# EAGLE design led-strip-v2 (EAGLE 9.3.0)
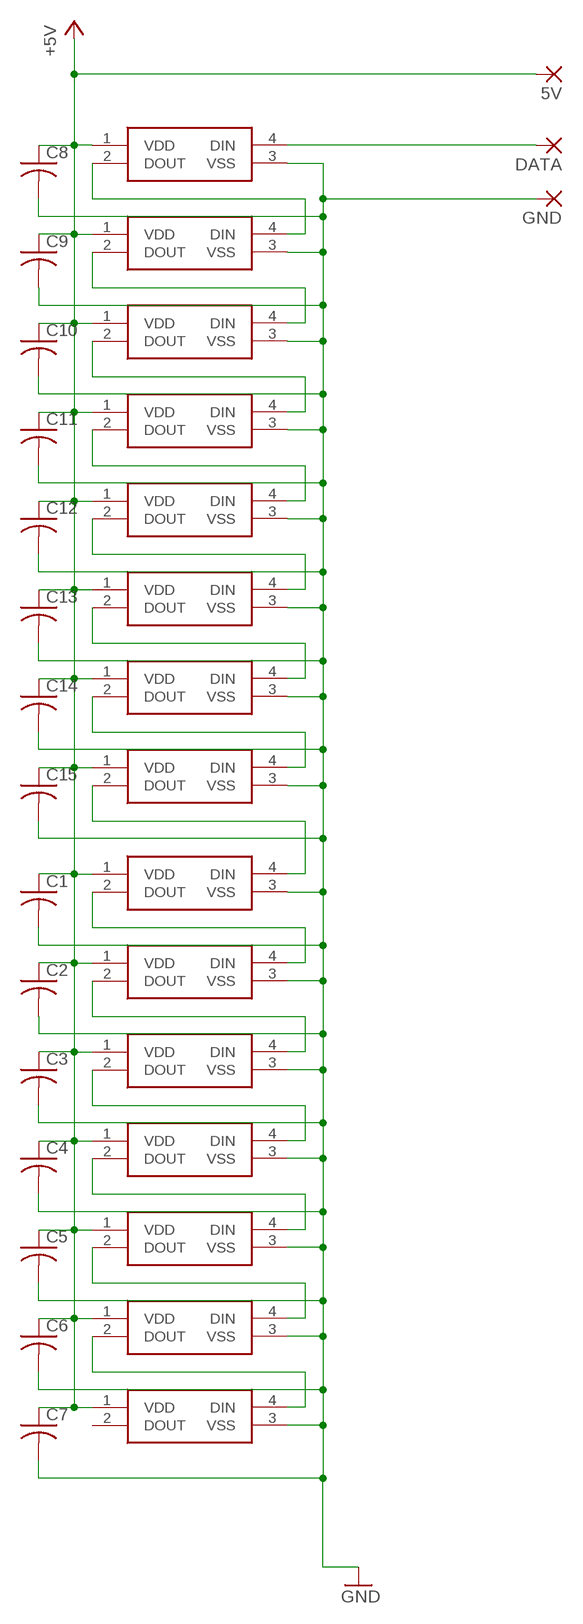
[diagram p0: schematic, sheet 1]

## Parts
5V  1,6/0,8  [1,6/0,8]
C1  C-USC0805  [C0805]
C2  C-USC0805  [C0805]
C3  C-USC0805  [C0805]
C4  C-USC0805  [C0805]
C5  C-USC0805  [C0805]
C6  C-USC0805  [C0805]
C7  C-USC0805  [C0805]
C8  C-USC0805  [C0805]
C9  C-USC0805  [C0805]
C10  C-USC0805  [C0805]
C11  C-USC0805  [C0805]
C12  C-USC0805  [C0805]
C13  C-USC0805  [C0805]
C14  C-USC0805  [C0805]
C15  C-USC0805  [C0805]
DATA  1,6/0,8  [1,6/0,8]
GND  1,6/0,8  [1,6/0,8]
LED1  1655  [WS2812B_1]
LED2  1655  [WS2812B_1]
LED3  1655  [WS2812B_1]
LED4  1655  [WS2812B_1]
LED5  1655  [WS2812B_1]
LED6  1655  [WS2812B_1]
LED7  1655  [WS2812B_1]
LED8  1655  [WS2812B_1]
LED9  1655  [WS2812B_1]
LED10  1655  [WS2812B_1]
LED11  1655  [WS2812B_1]
LED12  1655  [WS2812B_1]
LED13  1655  [WS2812B_1]
LED14  1655  [WS2812B_1]
LED15  1655  [WS2812B_1]

## Nets
+5V: 5V.1(P) C1.1 C2.1 C3.1 C4.1 C5.1 C6.1 C7.1 C8.1 C9.1 C10.1 C11.1 C12.1 C13.1 C14.1 C15.1 LED1.1(VDD) LED2.1(VDD) LED3.1(VDD) LED4.1(VDD) LED5.1(VDD) LED6.1(VDD) LED7.1(VDD) LED8.1(VDD) LED9.1(VDD) LED10.1(VDD) LED11.1(VDD) LED12.1(VDD) LED13.1(VDD) LED14.1(VDD) LED15.1(VDD)
DATA-IN: DATA.1(P) LED1.4(DIN)
GND: C1.2 C2.2 C3.2 C4.2 C5.2 C6.2 C7.2 C8.2 C9.2 C10.2 C11.2 C12.2 C13.2 C14.2 C15.2 GND.1(P) LED1.3(VSS) LED2.3(VSS) LED3.3(VSS) LED4.3(VSS) LED5.3(VSS) LED6.3(VSS) LED7.3(VSS) LED8.3(VSS) LED9.3(VSS) LED10.3(VSS) LED11.3(VSS) LED12.3(VSS) LED13.3(VSS) LED14.3(VSS) LED15.3(VSS)
N$1: LED1.2(DOUT) LED2.4(DIN)
N$2: LED2.2(DOUT) LED3.4(DIN)
N$3: LED3.2(DOUT) LED4.4(DIN)
N$4: LED4.2(DOUT) LED5.4(DIN)
N$5: LED5.2(DOUT) LED6.4(DIN)
N$6: LED6.2(DOUT) LED7.4(DIN)
N$7: LED7.2(DOUT) LED8.4(DIN)
N$8: LED8.2(DOUT) LED9.4(DIN)
N$9: LED9.2(DOUT) LED10.4(DIN)
N$10: LED10.2(DOUT) LED11.4(DIN)
N$11: LED11.2(DOUT) LED12.4(DIN)
N$12: LED12.2(DOUT) LED13.4(DIN)
N$13: LED13.2(DOUT) LED14.4(DIN)
N$14: LED14.2(DOUT) LED15.4(DIN)
Unconnected: LED15.2(DOUT)

## Library data of the parts
5V DATA GND = wirepad:1,6/0,8: THROUGH-HOLE PAD
C1-C15 = rcl:C-US: CAPACITOR, American symbol; SPICEPREFIX: C
LED1 = sk6812:1655: Intelligent control LED integrated light source, 4-pin SMD Source: Datasheet <http://www.adafruit.com/datasheets/WS2812B.pdf>; ALLIED_NUMBER: 70928826; DESCRIPTION: Intelligent control LED integrated light source, 4-pin SMD; HEIGHT: mm; MANUFACTURER_NAME: Adafruit; MANUFACTURER_PART_NUMBER: 1655
LED2-LED15 = 1655:1655: Intelligent control LED integrated light source, 4-pin SMD Source: Datasheet <http://www.adafruit.com/datasheets/WS2812B.pdf>; ALLIED_NUMBER: 70928826; DESCRIPTION: Intelligent control LED integrated light source, 4-pin SMD; HEIGHT: mm; MANUFACTURER_NAME: Adafruit; MANUFACTURER_PART_NUMBER: 1655

## Board
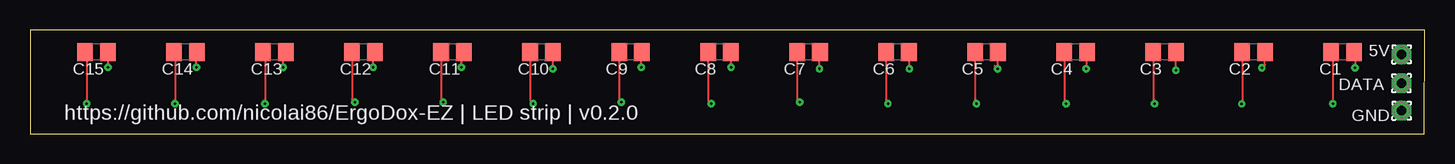
[diagram p1: board, top side]
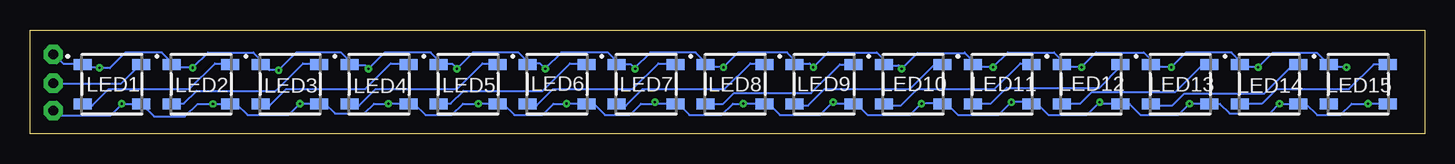
[diagram p2: board, bottom side, seen from below]

Size 116.26 x 8.68 mm. Coordinates in mm from the lower left corner, seen from the top.
Outline: 0,0 116.23,0 116.26,8.68 0,8.68 0,0
Copper layers (1*16): Top 0.035mm / dielectric 1.5mm / Bottom 0.035mm
Design rules "default": minimum track width 6mil, minimum drill 0.35mm, track to track 6mil, track to pad 6mil, pad to pad 6mil, via to via 6mil, smd to smd 6mil, copper to edge 40mil, drill to drill 6mil, minimum pad ring 10mil, minimum via ring 8mil, stop-mask expansion 4mil, vias tented up to drill 0mil, thermal gap 10mil

### Footprints (pad centres in the part's own frame; a part is rotated, then mirrored left to right if it is on the bottom)
1,6/0,8 = drill 0.813 pad 1.6 octagon: 1 0,0
C0805 = smd 1.3 x 1.5: 1 -0.95,0; 2 0.95,0
WS2812B_1 = smd 1.5 x 0.9: 1 -2.45,1.65; 2 -2.45,-1.65; 3 2.45,-1.65; 4 2.45,1.65

### Placement (x,y rotation side)
5V  114.33,6.63 90 top
C1  109.42,6.83 180 top
C2  102,6.83 180 top
C3  94.58,6.83 180 top
C4  87.16,6.83 180 top
C5  79.74,6.83 180 top
C6  72.32,6.83 180 top
C7  64.9,6.83 180 top
C8  57.48,6.83 180 top
C9  50.06,6.83 180 top
C10  42.64,6.83 180 top
C11  35.22,6.83 180 top
C12  27.8,6.83 180 top
C13  20.38,6.83 180 top
C14  12.96,6.83 180 top
C15  5.54,6.83 180 top
DATA  114.33,4.22 270 top
GND  114.33,1.93 90 top
LED1  109.42,4.14 0 bottom
LED2  102,4.14 0 bottom
LED3  94.58,4.14 0 bottom
LED4  87.16,4.14 0 bottom
LED5  79.74,4.14 0 bottom
LED6  72.32,4.14 0 bottom
LED7  64.9,4.14 0 bottom
LED8  57.48,4.14 0 bottom
LED9  50.06,4.14 0 bottom
LED10  42.64,4.14 0 bottom
LED11  35.22,4.14 0 bottom
LED12  27.8,4.14 0 bottom
LED13  20.38,4.14 0 bottom
LED14  12.96,4.14 0 bottom
LED15  5.54,4.14 0 bottom

### Tracks (layer width: path | path; a pad name or v marks a point on that pad's centre or on a via)
+5V  (via drill 0.2)
  Top 0.152: C1.1 110.46,6.74 v110.46,5.51 | C2.1 | C2.1 | C15.1 6.63,6.69 6.5,6.57 v6.5,5.56 | 14.12,6.62 C14.1 13.87,6.8 v13.87,5.56 | 21.07,5.6 v21.11,5.56 21.11,6.61 C13.1 | 28.49,5.67 v28.6,5.56 28.6,6.69 C12.1 | 35.79,5.74 v35.97,5.56 35.97,6.63 C11.1 | 43.46,5.56 v43.59,5.44 C10.1 | 50.88,5.63 v50.95,5.56 50.95,6.78 C9.1 | 58.3,5.71 v58.45,5.56 58.45,6.82 C8.1 | 80.44,5.67 v80.67,5.44 80.69,5.46 C5.1 | 87.86,5.62 v88.04,5.44 88.11,5.51 C4.1 | 95.41,5.19 v95.53,5.31 C3.1 | C2.1 102.95,5.77 v102.69,5.51 | v73.3,5.44 73.3,6.8 C6.1 | v65.81,5.44 65.81,6.8 C7.1
  Bottom 0.152: LED1.1 111.96,5.87 113.49,5.87 114.25,6.63 5V.1 | LED3.1 97.18,5.87 97.18,6.33 97.64,6.78 101.42,6.78 v102.69,5.51 104.17,5.51 LED2.1 | LED1.1 111.57,5.49 111.54,5.51 v110.46,5.51 110.44,5.49 109.6,5.49 108.31,6.78 105.26,6.78 104.34,5.87 LED2.1 | 97.03,5.87 LED3.1 | LED7.1 67.46,5.87 67.46,6.17 68.07,6.78 71.96,6.78 v73.3,5.44 73.74,5.87 74.63,5.87 | 59.84,5.87 60.76,6.78 64.54,6.78 65.89,5.44 v65.81,5.44 66.17,5.79 LED7.1 | 67.31,5.87 LED7.1 | 59.84,5.87 LED8.1 | 74.63,5.87 75.54,6.78 79.32,6.78 v80.67,5.44 81.04,5.81 82.17,5.81 | 82.09,5.87 82.17,5.81 | 82.17,5.81 LED5.1 82.25,5.87 82.25,6.17 82.85,6.78 86.69,6.78 v88.04,5.44 88.32,5.72 89.56,5.72 LED4.1 89.71,5.87 89.71,6.17 90.32,6.78 94.06,6.78 v95.53,5.31 96.29,5.31 96.77,5.79 LED3.1 | 74.63,5.87 LED6.1 74.68,5.79 | LED13.1 22.96,5.87 22.96,6.33 23.42,6.78 27.38,6.78 v28.6,5.56 30.02,5.56 LED12.1 | 30.12,5.87 LED12.1 | LED13.1 22.81,5.87 22.76,5.87 22.45,5.56 v21.11,5.56 19.89,6.78 16.1,6.78 15.49,6.17 15.49,5.87 LED14.1 15.41,5.71 15.27,5.56 v13.87,5.56 12.7,6.73 8.93,6.73 LED15.1 7.76,5.56 v6.5,5.56 6.74,5.56 | 38.35,6.78 38.33,6.76 | 38.33,6.76 37.74,6.17 37.74,5.87 LED11.1 37.59,5.87 37.49,5.87 37.19,5.56 v35.97,5.56 34.75,6.78 30.89,6.78 30.28,6.17 30.28,5.87 LED12.1 | 52.37,5.87 51.26,5.87 v50.95,5.56 49.73,6.78 45.67,6.78 45.21,6.33 45.21,5.87 LED10.1 45.06,5.72 43.87,5.72 v43.59,5.44 42.27,6.76 38.33,6.76 | 52.37,5.87 LED9.1 | LED1.1 111.62,5.54 | 104.37,5.79 LED2.1 | 22.73,5.79 LED13.1 | 30.1,5.79 LED12.1 | 59.84,5.87 59.84,5.82 59.59,5.56 v58.45,5.56 57.23,6.78 53.14,6.78 52.53,6.17 52.53,5.87 52.37,5.87
DATA-IN
  Bottom 0.152: LED1.4 107.03,5.83 108.66,4.19 114.25,4.19 DATA.1
GND  (via drill 0.2)
  Top 0.152: C1.2 108.61,6.7 v108.61,2.52 | C2.2 101.05,2.53 v101.02,2.49 | C15.2 4.72,6.7 v4.72,2.52 | C14.2 12.09,6.75 v12.09,2.52 | C13.2 19.58,6.68 v19.58,2.52 | C12.2 26.85,2.87 v27.08,2.64 | C11.2 34.27,2.82 v34.44,2.64 | C10.2 41.69,2.76 v41.94,2.52 | C9.2 49.11,2.84 v49.3,2.64 | C8.2 56.53,2.78 v56.79,2.52 | C7.2 63.95,2.85 v64.16,2.64 | C6.2 71.37,2.67 v71.53,2.52 | C5.2 78.79,2.62 v78.89,2.52 | C4.2 86.21,2.69 v86.39,2.52 | C3.2 93.63,2.64 v93.75,2.52
  Bottom 0.152: v108.61,2.52 108.59,2.49 | 108.59,2.49 LED1.3 105.91,1.43 103.35,1.43 102.3,2.49 v101.02,2.49 LED2.3 99.06,2.49 98.13,1.56 94.71,1.56 v93.75,2.52 93.73,2.49 LED3.3 91.64,2.49 90.84,1.69 88.39,1.69 87.58,2.49 86.36,2.49 | GND.1 113.94,1.55 109.53,1.55 108.59,2.49 | LED15.3 4.7,2.49 | 4.7,2.49 v4.72,2.52 | 56.77,2.49 LED8.3 54.67,2.49 53.74,1.56 50.39,1.56 v49.3,2.64 49.15,2.49 LED9.3 47.37,2.49 46.44,1.56 42.89,1.56 v41.94,2.52 40.21,2.52 LED10.3 39.83,2.49 38.89,1.56 35.53,1.56 v34.44,2.64 32.92,2.64 LED11.3 32.28,2.49 31.35,1.56 28.16,1.56 v27.08,2.64 26.93,2.49 LED12.3 24.61,2.49 23.67,1.56 20.54,1.56 v19.58,2.52 19.56,2.49 LED13.3 17.06,2.49 16.25,1.69 12.92,1.69 v12.09,2.52 12.07,2.49 LED14.3 9.89,2.49 8.96,1.56 7.02,1.56 6.08,2.49 4.7,2.49 | 56.77,2.49 v56.79,2.52 | 64.01,2.49 LED7.3 62.22,2.49 61.28,1.56 58.59,1.56 57.66,2.49 56.77,2.49 | 64.01,2.49 v64.16,2.64 | 71.5,2.49 LED6.3 69.25,2.49 68.32,1.56 66.25,1.56 65.32,2.49 64.01,2.49 | 71.5,2.49 v71.53,2.52 | 78.87,2.49 LED5.3 76.8,2.49 75.87,1.56 73.55,1.56 72.61,2.49 71.5,2.49 | 78.87,2.49 v78.89,2.52 | 86.36,2.49 LED4.3 84.22,2.49 83.29,1.56 81.09,1.56 80.16,2.49 78.87,2.49 | 86.36,2.49 v86.39,2.52
N$1
  Bottom 0.152: LED2.4 99.62,5.87 100.84,5.87 102.97,3.74 109.68,3.74 111.05,2.36 111.81,2.36 LED1.2
N$2
  Bottom 0.152: LED3.4 92.15,5.87 93.5,5.87 95.78,3.58 102.36,3.58 103.43,2.52 104.34,2.52 LED2.2
N$3
  Bottom 0.152: LED4.4 84.84,5.87 86.18,5.87 88.32,3.74 94.89,3.74 96.27,2.36 97.03,2.36 LED3.2
N$4
  Bottom 0.152: LED5.4 77.37,5.87 78.54,5.87 80.67,3.74 87.43,3.74 88.8,2.36 89.56,2.36 LED4.2
N$5
  Bottom 0.152: LED6.4 69.9,5.87 71.25,5.87 73.53,3.58 80.11,3.58 81.18,2.52 82.09,2.52 LED5.2
N$6
  Bottom 0.152: LED7.4 62.59,5.87 63.88,5.87 66.01,3.74 72.64,3.74 74.02,2.36 74.63,2.36 LED6.2
N$7
  Bottom 0.152: LED8.4 55.12,5.87 56.21,5.87 58.34,3.74 65.18,3.74 66.55,2.36 67.31,2.36 LED7.2
N$8
  Bottom 0.152: LED8.2 58.47,2.49 57.56,3.41 51.14,3.41 48.75,5.79 LED9.4
N$9
  Bottom 0.152: LED10.4 40.34,5.87 40.77,5.87 42.9,3.74 50.01,3.74 51.38,2.36 52.37,2.36 LED9.2
N$10
  Bottom 0.152: LED11.4 32.87,5.87 33.71,5.87 35.84,3.74 42.29,3.74 43.66,2.36 45.06,2.36 LED10.2
N$11
  Bottom 0.152: LED12.4 25.35,5.62 27.13,3.84 34.85,3.84 36.17,2.52 37.59,2.52 LED11.2
N$12
  Bottom 0.152: LED12.2 30.12,2.52 28.7,2.52 27.76,3.46 20.8,3.46 18.47,5.79 LED13.4
N$13
  Bottom 0.152: 10.46,5.87 LED14.4 10.96,5.79 13.42,3.34 20.06,3.34 21.03,2.36 22.81,2.36 LED13.2
N$14
  Bottom 0.152: LED14.2 15.34,2.52 13.54,2.52 12.32,3.74 6.3,3.74 4.24,5.79 LED15.4

### Text on the board
tPlace: https://github.com/nicolai86/ErgoDox-EZ | LED strip | v0.2.0